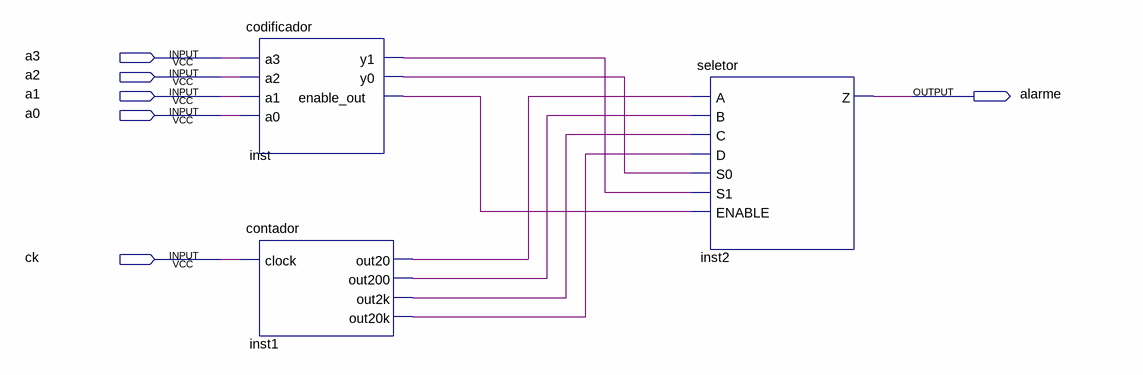
[diagram p0: schematic sheet]
// Quartus schematic alarme.bdf as structural Verilog: 3 symbols, 6 pins
module alarme (
  input  a3,
  input  a2,
  input  a1,
  input  a0,
  input  ck,
  output alarme
);

  wire inst1_out2k, inst1_out20, inst1_out20k, inst1_out200, inst_enable_out, inst_y0, inst_y1;

  codificador inst (.a3(a3), .a2(a2), .a1(a1), .a0(a0), .y1(inst_y1), .y0(inst_y0), .enable_out(inst_enable_out));
  contador inst1 (.clock(ck), .out20(inst1_out20), .out200(inst1_out200), .out2k(inst1_out2k), .out20k(inst1_out20k));
  seletor inst2 (
    .A(inst1_out20), .B(inst1_out200), .C(inst1_out2k), .D(inst1_out20k), .S0(inst_y0), .S1(inst_y1),
    .ENABLE(inst_enable_out), .Z(alarme));
endmodule
